# EAGLE design dashboard (EAGLE 6.3)
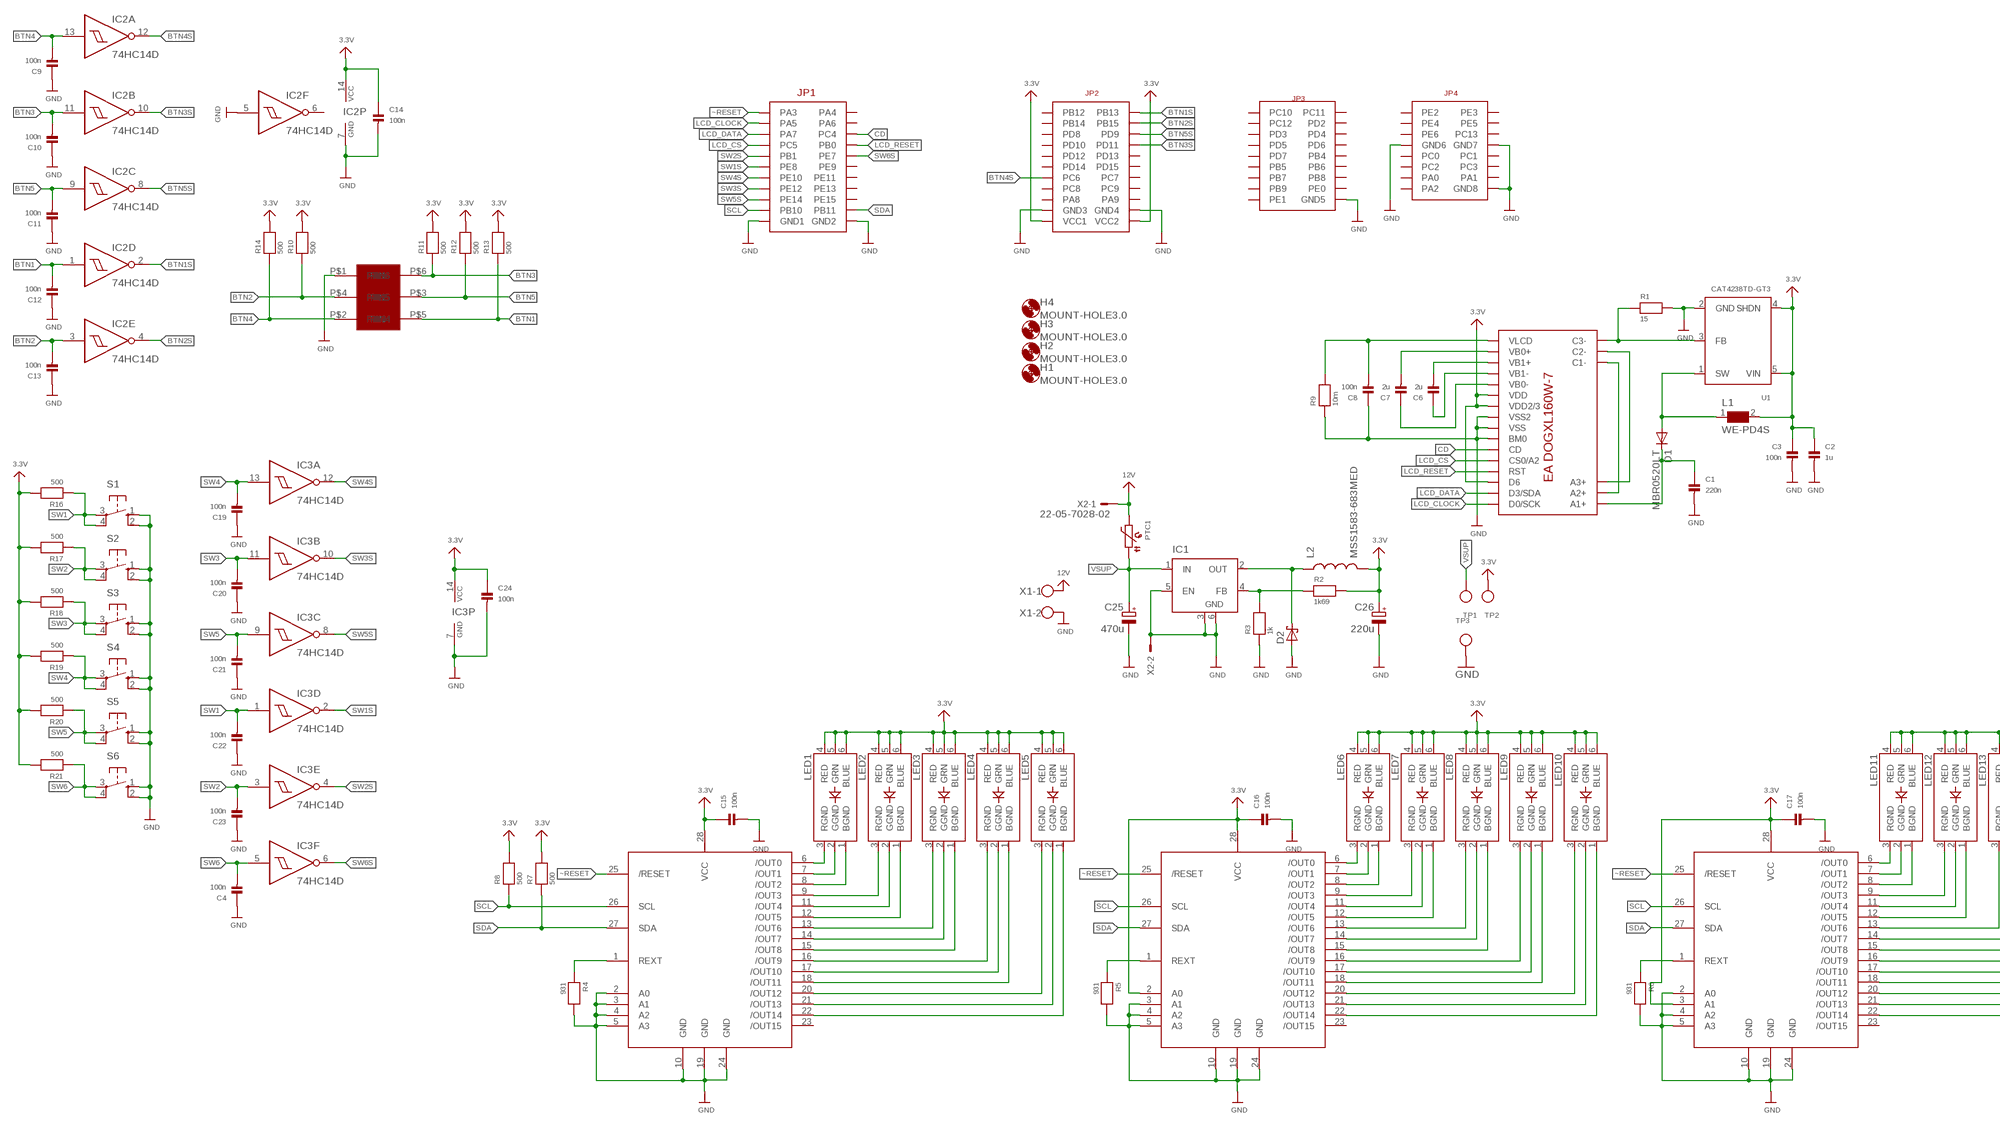
[diagram p0: schematic, sheet 1, part 1 of 2]
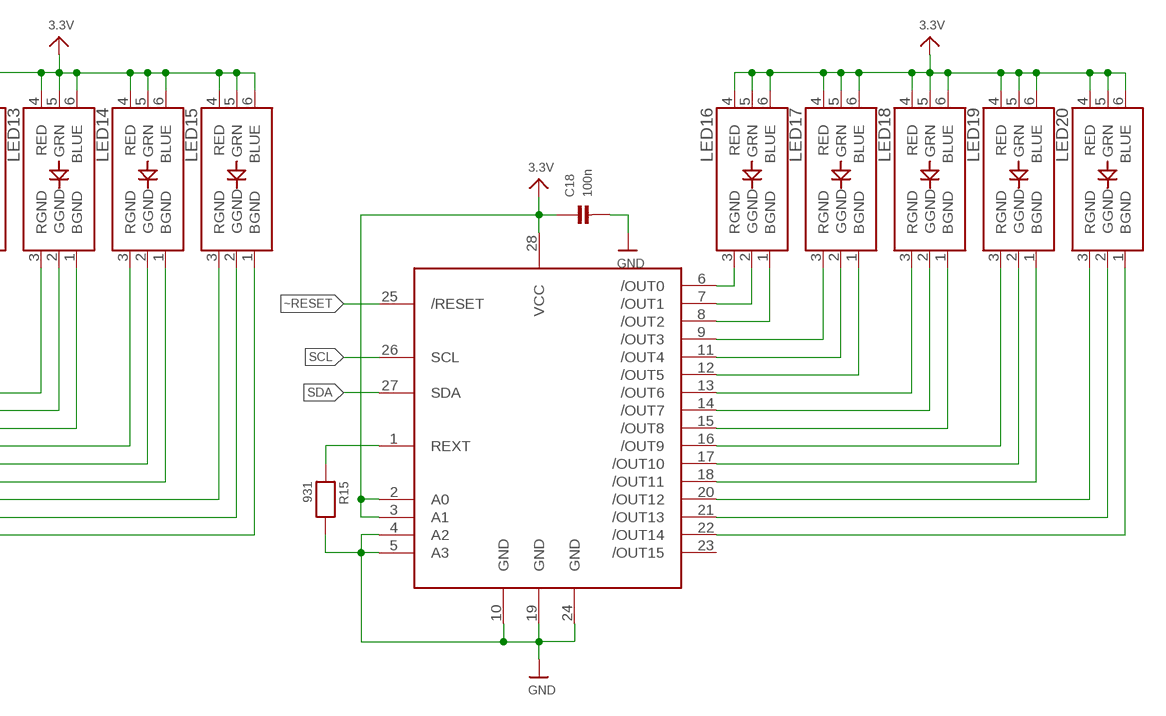
[diagram p1: schematic, sheet 1, part 2 of 2]

## Parts
C1  220n  CAP_CERAMIC_0805  [_0805]
C2  1u  CAP_CERAMIC_0805  [_0805]
C3  100n  CAP_CERAMIC_0603  [_0603]
C4  100n  CAP_CERAMIC_0603  [_0603]
C6  2u  CAP_CERAMIC_0805  [_0805]
C7  2u  CAP_CERAMIC_0805  [_0805]
C8  100n  CAP_CERAMIC_0603  [_0603]
C9  100n  CAP_CERAMIC_0603  [_0603]
C10  100n  CAP_CERAMIC_0603  [_0603]
C11  100n  CAP_CERAMIC_0603  [_0603]
C12  100n  CAP_CERAMIC_0603  [_0603]
C13  100n  CAP_CERAMIC_0603  [_0603]
C14  100n  CAP_CERAMIC_0603  [_0603]
C15  100n  CAP_CERAMIC_0603  [_0603]
C16  100n  CAP_CERAMIC_0603  [_0603]
C17  100n  CAP_CERAMIC_0603  [_0603]
C18  100n  CAP_CERAMIC_0603  [_0603]
C19  100n  CAP_CERAMIC_0603  [_0603]
C20  100n  CAP_CERAMIC_0603  [_0603]
C21  100n  CAP_CERAMIC_0603  [_0603]
C22  100n  CAP_CERAMIC_0603  [_0603]
C23  100n  CAP_CERAMIC_0603  [_0603]
C24  100n  CAP_CERAMIC_0603  [_0603]
C25  470u  CPOL-EU153CLV-1012  [153CLV-1012]
C26  220u  CPOL-EU153CLV-1012  [153CLV-1012]
D1  MBR0520LT  [SOD123]
D2  SCHOTTKY-DIODESMC  [SMC]
H1  MOUNT-HOLE3.0  [3,0]
H2  MOUNT-HOLE3.0  [3,0]
H3  MOUNT-HOLE3.0  [3,0]
H4  MOUNT-HOLE3.0  [3,0]
IC1  LM2596S  [TO263-5]
IC2  74HC14D  [SO14]
IC3  74HC14D  [SO14]
L1  WE-PD4S  WE-PD4-7445501_S  [S]
L2  MSS1583-683MED  INDUCTORPWR  [CDRH125]
LED1  LED_RGB_PLCC6CREE-CLV6A  [RGBLED_PLCC6]
LED2  LED_RGB_PLCC6CREE-CLV6A  [RGBLED_PLCC6]
LED3  LED_RGB_PLCC6CREE-CLV6A  [RGBLED_PLCC6]
LED4  LED_RGB_PLCC6CREE-CLV6A  [RGBLED_PLCC6]
LED5  LED_RGB_PLCC6CREE-CLV6A  [RGBLED_PLCC6]
LED6  LED_RGB_PLCC6CREE-CLV6A  [RGBLED_PLCC6]
LED7  LED_RGB_PLCC6CREE-CLV6A  [RGBLED_PLCC6]
LED8  LED_RGB_PLCC6CREE-CLV6A  [RGBLED_PLCC6]
LED9  LED_RGB_PLCC6CREE-CLV6A  [RGBLED_PLCC6]
LED10  LED_RGB_PLCC6CREE-CLV6A  [RGBLED_PLCC6]
LED11  LED_RGB_PLCC6CREE-CLV6A  [RGBLED_PLCC6]
LED12  LED_RGB_PLCC6CREE-CLV6A  [RGBLED_PLCC6]
LED13  LED_RGB_PLCC6CREE-CLV6A  [RGBLED_PLCC6]
LED14  LED_RGB_PLCC6CREE-CLV6A  [RGBLED_PLCC6]
LED15  LED_RGB_PLCC6CREE-CLV6A  [RGBLED_PLCC6]
LED16  LED_RGB_PLCC6CREE-CLV6A  [RGBLED_PLCC6]
LED17  LED_RGB_PLCC6CREE-CLV6A  [RGBLED_PLCC6]
LED18  LED_RGB_PLCC6CREE-CLV6A  [RGBLED_PLCC6]
LED19  LED_RGB_PLCC6CREE-CLV6A  [RGBLED_PLCC6]
LED20  LED_RGB_PLCC6CREE-CLV6A  [RGBLED_PLCC6]
PTC1  PTC1812  [PTC1812]
R1  15  RESISTOR_0603  [_0603]
R2  1k69  RESISTOR_0603  [_0603]
R3  1k  RESISTOR_0603  [_0603]
R4  931  RESISTOR_0603  [_0603]
R5  931  RESISTOR_0603  [_0603]
R6  931  RESISTOR_0603  [_0603]
R7  500  RESISTOR_0603  [_0603]
R8  500  RESISTOR_0603  [_0603]
R9  10m  RESISTOR_0805  [_0805]
R10  500  RESISTOR_0603  [_0603]
R11  500  RESISTOR_0603  [_0603]
R12  500  RESISTOR_0603  [_0603]
R13  500  RESISTOR_0603  [_0603]
R14  500  RESISTOR_0603  [_0603]
R15  931  RESISTOR_0603  [_0603]
R16  500  RESISTOR_0603  [_0603]
R17  500  RESISTOR_0603  [_0603]
R18  500  RESISTOR_0603  [_0603]
R19  500  RESISTOR_0603  [_0603]
R20  500  RESISTOR_0603  [_0603]
R21  500  RESISTOR_0603  [_0603]
S1  10-XX  [B3F-10XX]
S2  10-XX  [B3F-10XX]
S3  10-XX  [B3F-10XX]
S4  10-XX  [B3F-10XX]
S5  10-XX  [B3F-10XX]
S6  10-XX  [B3F-10XX]
TP1  TESTPOINT  [TESTPOINT_SMT]
TP2  TESTPOINT  [TESTPOINT_SMT]
TP3  TESTPOINT  [TESTPOINT_SMT]
U1  CAT4238TD-GT3  FAN5331  [SOT23-5]
U$1  CPU-BOARD  [CPU-BOARD-JP1]
U$10  EA-DOGXL160W-7  [EA-DOGXL160W-7]
U$30  TLC59116  [TSSOP28]
U$33  TLC59116  [TSSOP28]
U$36  TLC59116  [TSSOP28]
U$42  MICROFIT6  [43045-0600]
U$51  TLC59116  [TSSOP28]
X1  W237-102  [W237-102]
X2  22-05-7028-02  [7395-02]

## Nets
3.3V: C2.1 C3.1 C14.1 C15.1 C16.1 C17.1 C18.1 C24.1 C26.+ IC2.14(P:VCC) IC3.14(P:VCC) L1.2 L2.2 LED1.4(RED) LED1.5(GRN) LED1.6(BLUE) LED2.4(RED) LED2.5(GRN) LED2.6(BLUE) LED3.4(RED) LED3.5(GRN) LED3.6(BLUE) LED4.4(RED) LED4.5(GRN) LED4.6(BLUE) LED5.4(RED) LED5.5(GRN) LED5.6(BLUE) LED6.4(RED) LED6.5(GRN) LED6.6(BLUE) LED7.4(RED) LED7.5(GRN) LED7.6(BLUE) LED8.4(RED) LED8.5(GRN) LED8.6(BLUE) LED9.4(RED) LED9.5(GRN) LED9.6(BLUE) LED10.4(RED) LED10.5(GRN) LED10.6(BLUE) LED11.4(RED) LED11.5(GRN) LED11.6(BLUE) LED12.4(RED) LED12.5(GRN) LED12.6(BLUE) LED13.4(RED) LED13.5(GRN) LED13.6(BLUE) LED14.4(RED) LED14.5(GRN) LED14.6(BLUE) LED15.4(RED) LED15.5(GRN) LED15.6(BLUE) LED16.4(RED) LED16.5(GRN) LED16.6(BLUE) LED17.4(RED) LED17.5(GRN) LED17.6(BLUE) LED18.4(RED) LED18.5(GRN) LED18.6(BLUE) LED19.4(RED) LED19.5(GRN) LED19.6(BLUE) LED20.4(RED) LED20.5(GRN) LED20.6(BLUE) R2.2 R7.2 R8.2 R10.2 R11.2 R12.2 R13.2 R14.2 R16.2 R17.2 R18.2 R19.2 R20.2 R21.2 TP2.P$1 U1.4(SHDN) U1.5(VIN) U$1.P$43(VCC1) U$1.P$44(VCC2) U$10.P$22(VDD) U$10.P$23(VDD2/3) U$10.P$30(D6) U$30.28(VCC) U$33.2(A0) U$33.28(VCC) U$36.3(A1) U$36.28(VCC) U$51.2(A0) U$51.3(A1) U$51.28(VCC)
12V: PTC1.P$2 X1.1 X2.1
BTN1: C12.2 IC2.1(D:I) R13.1 U$42.P$5(PIN4)
BTN1S: IC2.2(D:O) U$1.P$24(PB13)
BTN2: C13.2 IC2.3(E:I) R10.1 U$42.P$4(PIN2)
BTN2S: IC2.4(E:O) U$1.P$26(PB15)
BTN3: C10.2 IC2.11(B:I) R11.1 U$42.P$6(PIN6)
BTN3S: IC2.10(B:O) U$1.P$30(PD11)
BTN4: C9.2 IC2.13(A:I) R14.1 U$42.P$2(PIN3)
BTN4S: IC2.12(A:O) U$1.P$35(PC6)
BTN5: C11.2 IC2.9(C:I) R12.1 U$42.P$3(PIN5)
BTN5S: IC2.8(C:O) U$1.P$28(PD9)
CD: U$1.P$6(PC4) U$10.P$27(CD)
GND: C1.2 C2.2 C3.2 C4.1 C8.1 C9.1 C10.1 C11.1 C12.1 C13.1 C14.2 C15.2 C16.2 C17.2 C18.2 C19.1 C20.1 C21.1 C22.1 C23.1 C24.2 C25.- C26.- D2.A IC1.3(GND) IC1.5(EN) IC1.6(GND) IC2.5(F:I) IC2.7(P:GND) IC3.7(P:GND) R1.2 R3.1 R4.2 R5.2 R6.2 R9.1 R15.2 S1.1(S) S1.2(S1) S2.1(S) S2.2(S1) S3.1(S) S3.2(S1) S4.1(S) S4.2(S1) S5.1(S) S5.2(S1) S6.1(S) S6.2(S1) TP3.P$1 U1.2(GND) U$1.P$19(GND1) U$1.P$20(GND2) U$1.P$41(GND3) U$1.P$42(GND4) U$1.P$62(GND5) U$1.P$69(GND6) U$1.P$70(GND7) U$1.P$78(GND8) U$10.P$24(VSS2) U$10.P$25(VSS) U$10.P$26(BM0) U$30.2(A0) U$30.3(A1) U$30.4(A2) U$30.5(A3) U$30.10(GND) U$30.19(GND) U$30.24(GND) U$33.3(A1) U$33.4(A2) U$33.5(A3) U$33.10(GND) U$33.19(GND) U$33.24(GND) U$36.2(A0) U$36.4(A2) U$36.5(A3) U$36.10(GND) U$36.19(GND) U$36.24(GND) U$42.P$1(PIN1) U$51.4(A2) U$51.5(A3) U$51.10(GND) U$51.19(GND) U$51.24(GND) X1.2 X2.2
LCD_CLOCK: U$1.P$3(PA5) U$10.P$32(D0/SCK)
LCD_CS: U$1.P$7(PC5) U$10.P$28(CS0/A2)
LCD_DATA: U$1.P$5(PA7) U$10.P$31(D3/SDA)
LCD_RESET: U$1.P$8(PB0) U$10.P$29(RST)
N$1: U$10.P$2(A2+) U$10.P$14(C1-)
N$2: U$10.P$3(A3+) U$10.P$15(C2-)
N$3: R1.1 U1.3(FB) U$10.P$16(C3-)
N$4: C1.1 D1.C U$10.P$1(A1+)
N$5: D1.A L1.1 U1.1(SW)
N$6: D2.C IC1.2(OUT) L2.1
N$7: LED1.3(RGND) U$30.6(/OUT0)
N$8: LED1.2(GGND) U$30.7(/OUT1)
N$9: IC1.4(FB) R2.1 R3.2
N$10: LED1.1(BGND) U$30.8(/OUT2)
N$11: LED2.3(RGND) U$30.9(/OUT3)
N$12: LED2.2(GGND) U$30.11(/OUT4)
N$13: LED2.1(BGND) U$30.12(/OUT5)
N$14: LED3.3(RGND) U$30.13(/OUT6)
N$15: LED3.2(GGND) U$30.14(/OUT7)
N$16: LED3.1(BGND) U$30.15(/OUT8)
N$17: LED4.3(RGND) U$30.16(/OUT9)
N$18: LED4.2(GGND) U$30.17(/OUT10)
N$19: LED4.1(BGND) U$30.18(/OUT11)
N$20: LED5.3(RGND) U$30.20(/OUT12)
N$21: LED5.2(GGND) U$30.21(/OUT13)
N$22: LED5.1(BGND) U$30.22(/OUT14)
N$23: LED6.3(RGND) U$33.6(/OUT0)
N$24: LED6.2(GGND) U$33.7(/OUT1)
N$25: LED6.1(BGND) U$33.8(/OUT2)
N$26: LED7.3(RGND) U$33.9(/OUT3)
N$27: LED7.2(GGND) U$33.11(/OUT4)
N$28: LED7.1(BGND) U$33.12(/OUT5)
N$29: LED8.3(RGND) U$33.13(/OUT6)
N$30: LED8.2(GGND) U$33.14(/OUT7)
N$31: LED8.1(BGND) U$33.15(/OUT8)
N$32: LED9.3(RGND) U$33.16(/OUT9)
N$33: LED9.2(GGND) U$33.17(/OUT10)
N$34: LED9.1(BGND) U$33.18(/OUT11)
N$35: LED10.3(RGND) U$33.20(/OUT12)
N$36: LED10.2(GGND) U$33.21(/OUT13)
N$37: LED10.1(BGND) U$33.22(/OUT14)
N$38: LED11.3(RGND) U$36.6(/OUT0)
N$39: LED11.2(GGND) U$36.7(/OUT1)
N$40: LED11.1(BGND) U$36.8(/OUT2)
N$41: LED12.3(RGND) U$36.9(/OUT3)
N$42: LED12.2(GGND) U$36.11(/OUT4)
N$43: LED12.1(BGND) U$36.12(/OUT5)
N$44: LED13.3(RGND) U$36.13(/OUT6)
N$45: LED13.2(GGND) U$36.14(/OUT7)
N$46: LED13.1(BGND) U$36.15(/OUT8)
N$47: LED14.3(RGND) U$36.16(/OUT9)
N$48: LED14.2(GGND) U$36.17(/OUT10)
N$49: LED14.1(BGND) U$36.18(/OUT11)
N$50: LED15.3(RGND) U$36.20(/OUT12)
N$51: LED15.2(GGND) U$36.21(/OUT13)
N$52: LED15.1(BGND) U$36.22(/OUT14)
N$53: R4.1 U$30.1(REXT)
N$54: LED16.3(RGND) U$51.6(/OUT0)
N$55: R5.1 U$33.1(REXT)
N$56: R6.1 U$36.1(REXT)
N$57: C6.1 U$10.P$20(VB1-)
N$58: C7.1 U$10.P$21(VB0-)
N$59: C6.2 U$10.P$19(VB1+)
N$60: C7.2 U$10.P$18(VB0+)
N$61: C8.2 R9.2 U$10.P$17(VLCD)
N$62: LED16.2(GGND) U$51.7(/OUT1)
N$63: LED16.1(BGND) U$51.8(/OUT2)
N$64: LED17.3(RGND) U$51.9(/OUT3)
N$65: LED17.2(GGND) U$51.11(/OUT4)
N$66: LED17.1(BGND) U$51.12(/OUT5)
N$67: LED18.3(RGND) U$51.13(/OUT6)
N$68: LED18.2(GGND) U$51.14(/OUT7)
N$69: LED18.1(BGND) U$51.15(/OUT8)
N$70: LED19.3(RGND) U$51.16(/OUT9)
N$71: LED19.2(GGND) U$51.17(/OUT10)
N$72: LED19.1(BGND) U$51.18(/OUT11)
N$73: LED20.3(RGND) U$51.20(/OUT12)
N$74: LED20.2(GGND) U$51.21(/OUT13)
N$75: LED20.1(BGND) U$51.22(/OUT14)
N$76: R15.1 U$51.1(REXT)
SCL: R8.1 U$1.P$21(PB10) U$30.26(SCL) U$33.26(SCL) U$36.26(SCL) U$51.26(SCL)
SDA: R7.1 U$1.P$22(PB11) U$30.27(SDA) U$33.27(SDA) U$36.27(SDA) U$51.27(SDA)
SW1: C22.2 IC3.1(D:I) R16.1 S1.3(P) S1.4(P1)
SW1S: IC3.2(D:O) U$1.P$11(PE8)
SW2: C23.2 IC3.3(E:I) R17.1 S2.3(P) S2.4(P1)
SW2S: IC3.4(E:O) U$1.P$9(PB1)
SW3: C20.2 IC3.11(B:I) R18.1 S3.3(P) S3.4(P1)
SW3S: IC3.10(B:O) U$1.P$15(PE12)
SW4: C19.2 IC3.13(A:I) R19.1 S4.3(P) S4.4(P1)
SW4S: IC3.12(A:O) U$1.P$13(PE10)
SW5: C21.2 IC3.9(C:I) R20.1 S5.3(P) S5.4(P1)
SW5S: IC3.8(C:O) U$1.P$17(PE14)
SW6: C4.2 IC3.5(F:I) R21.1 S6.3(P) S6.4(P1)
SW6S: IC3.6(F:O) U$1.P$10(PE7)
VSUP: C25.+ IC1.1(IN) PTC1.P$1 TP1.P$1
~RESET: U$1.P$1(PA3) U$30.25(/RESET) U$33.25(/RESET) U$36.25(/RESET) U$51.25(/RESET)
Unconnected: IC2.6(F:O) U$1.P$2(PA4) U$1.P$4(PA6) U$1.P$12(PE9) U$1.P$14(PE11) U$1.P$16(PE13) U$1.P$18(PE15) U$1.P$23(PB12) U$1.P$25(PB14) U$1.P$27(PD8) U$1.P$29(PD10) U$1.P$31(PD12) U$1.P$32(PD13) U$1.P$33(PD14) U$1.P$34(PD15) U$1.P$36(PC7) U$1.P$37(PC8) U$1.P$38(PC9) U$1.P$39(PA8) U$1.P$40(PA9) U$1.P$45(PC10) U$1.P$46(PC11) U$1.P$47(PC12) U$1.P$48(PD2) U$1.P$49(PD3) U$1.P$50(PD4) U$1.P$51(PD5) U$1.P$52(PD6) U$1.P$53(PD7) U$1.P$54(PB4) U$1.P$55(PB5) U$1.P$56(PB6) U$1.P$57(PB7) U$1.P$58(PB8) U$1.P$59(PB9) U$1.P$60(PE0) U$1.P$61(PE1) U$1.P$63(PE2) U$1.P$64(PE3) U$1.P$65(PE4) U$1.P$66(PE5) U$1.P$67(PE6) U$1.P$68(PC13) U$1.P$71(PC0) U$1.P$72(PC1) U$1.P$73(PC2) U$1.P$74(PC3) U$1.P$75(PA0) U$1.P$76(PA1) U$1.P$77(PA2) U$30.23(/OUT15) U$33.23(/OUT15) U$36.23(/OUT15) U$51.23(/OUT15)

## Library data of the parts
C1-C4 C6-C24 = microbuilder:CAP_CERAMIC: Ceramic Capacitors 0402 - 0402 Surface Mount Capacitors 16pF 50V 5% [Digikey: 445-4899-2-ND] 18pF 50V 5% [Digikey: 490-1281-2-ND] 22pF 50V 5% [Digikey: 490-1283-2-ND] 68pF 50V 5% [Digikey: 490-1289-2-ND] 0.1uF 10V 10% [Digikey: 490-1318-2-ND] 1.0uF 6.3V 10% [Digikey: 490-1320-2-ND] 0603 - 0603 Surface Mount Capacitors 16 pF 50V 5% [Digikey: 445-5051-2-ND] 22 pF 50V [Digikey: PCC220ACVTR-ND] 33 pF 50V 5% [Digikey: 490-1415-1-ND] 56pF 50V 5% [Digikey: 490-1421-1-ND] 220pF 50V 5% [Digikey: 445-1285-1-ND] 680 pF 50V 2200 pF 50V 5% C0G [Digikey: 445-1297-1-ND] 5600 pF 100V 5% X7R [Digikey: 478-3711-1-ND] 0.1 µF 25V 10% [Digikey: PCC2277TR-ND] 0.22 µF 16V 10% X7R [Digikey: 445-1318-1-ND] 1.0 µF 25V 10% [Digikey: 445-5146-2-ND] 0603 - RF Specific 3pF 250V +/-0.1pF RF [Digikey: 712-1347-1-ND] 18 pF 250V 5% [Digikey: 478-3505-1-ND or 712-1322-1-ND] 56 pF 250V 5% C0G RF [Digikey: 490-4867-1-ND] 68 pF 250V RF [Digikey: 490-4868-1-ND] 0805 - 0805 Surface Mount Capacitors 220 pF 250V 2% RF Ceramic Capacitor [Digikey: 712-1398-1-ND] 1000 pF 50V 2% NP0 Ceramic Capacitor [Digikey: 478-3760-1-ND] 0.1 µF 25V 10% Ceramic Capacitor [Digikey: PCC1828TR-ND] 1.0 µF 16V 10% Ceramic Capacitor[Digikey: 490-1691-2-ND] 10.0 µF 10V 10% Ceramic Capacitor[Digikey: 709-1228-1-ND] 10.0 uF 16V 10% Ceramic Capacitor [Digikey: 478-5165-2-ND] 47 uF 6.3V 20% Ceramic Capacitor [Digikey: 587-1779-1-ND or 399-5506-1-ND] 1206 - 1206 Surface Mount Capacitors 47uF 10V 20% Ceramic Capacitor [Digikey: 490-5528-1-ND or 399-5508-1-ND or 445-6010-1-ND] 100uF 6.3V -20%, +80% Y5V Ceramic Capacitor (Digikey: 490-4512-1-ND, Mouser: 81-GRM31CF50J107ZE1L)
C25 C26 = rcl:CPOL-EU: POLARIZED CAPACITOR, European symbol
D1 = diode:MBR0520LT: SCHOTTKY BARRIER RECTIFIER Source: http://onsemi.com .. MBR0520LT1-D.pdf
D2 = diode:SCHOTTKY-DIODE: Schottky Diode
H1-H4 = holes:MOUNT-HOLE: MOUNTING HOLE with drill center marker
IC1 = linear:LM2596S: STEP-DOWN VOLTAGE REGULATOR
IC2 IC3 = 74xx-eu:74*14: Hex schmitt trigger INVERTER
L1 = WE-PD4:WE-PD4: SMD-Power Inductors WE-PD4 - Current loading up to 35 A - Compact size - Low-loss ferrite core - High storage capacity - Industry standardized size - Application frequency range up to 10 MHz -- Is recommended for the application with switching regulators from National Semiconductor, Linear Technology, Texas Instruments and Fairchild Semiconductor -- Noise suppression -- Perfectly suitable for switching regulators with extremely high efficiency; MPN: 7445501; OC_FARNELL: 1636112; OC_NEWARK: 08P2667; PACKAGE: Type S; SUPPLIER: Wuerth Elektronik
L2 = SparkFun-Passives:INDUCTOR: Inductors Basic Inductor/Choke - 0603 and 1206. Footprints are not proven and vary greatly between part numbers. INDUCTOR POWER 3.3UH 4.0A SMD 0.197" L x 0.197" W x 0.177" H (5.00mm x 5.00mm x 4.50mm)
LED1-LED20 = microbuilder:LED_RGB_PLCC6: RGB LED Cree CLV6A-FKB - Digikey: CLV6A-FKB-CK1P1G1BB7R3R3TR-ND DC Foreward Current: 20mA Foreward Voltage: R = 2.0, G = 3.2, B = 3.2 Viewing Angle: 120°
PTC1 = microbuilder:PTC: PTC (Resettable Fuse) 1206 Package 250mA PTC (16V Max, Time-to-Trip: 0.08s) - Digikey: F2110CT-ND 1210 Package 100mA PTC (30V Max, Time-to-Trip: 0.6s) - Digikey: MF-USMF010-2CT-ND 1812 Package 750mA PTC (24V Max, Time-to-Trip: 0.2s) - Digikey: MF-MSMF075/24-2CT-ND
R1-R21 = microbuilder:RESISTOR: Resistors 0402 - 0402 Surface Mount Package 22 Ohm 1% 1/16W [Digikey: 311-22.0LRTR-ND] 33 Ohm 5% 1/16W 1.0K 5% 1/16W 1.5K 5% 1/16W 2.0K 1% 1/16W 10.0K 1% 1/16W [Digikey: 311-10.0KLRTR-ND] 10.0K 5% 1/16W [Digikey: RMCF0402JT10K0TR-ND] 12.1K 1% 1/16W [Digikey: 311-22.0LRTR-ND] 100.0K 5% 1/16W 0603 - 0603 Surface Mount Package 0 Ohm 1/10 Watt 1% Resistor 15 Ohm 1/10 Watt 1% Resistor 33 Ohm 1/10 Watt 1% Resistor 49.9 Ohm 1/10 Watt 1% Resistor 100 Ohm 1/10 Watt 1% Resistor 150 Ohm 1/10 Watt 1% Resistor 240 Ohm 1/10 Watt 1% Resistor 390 Ohm 1/10 Watt 1% Resistor 560 Ohm 1/10 Watt 1% Resistor 680 Ohm 1/10 Watt 1% Resistor 750 Ohm 1/10 Watt 1% Resistor 1.0K Ohm 1/10 Watt 1% Resistor 1.5K Ohm 1/10 Watt 1% Resistor 2.0K Ohm 1/10 Watt 1% Resistor 2.2K Ohm 1/10 Watt 1% Resistor 3.3K Ohm 1/10 Watt 1% Resistor 4.7K Ohm 1/10 Watt 1% Resistor 10.0K Ohm 1/10 Watt 1% Resistor 12.0K Ohm 1/10 Watt 1% Resistor 12.1K Ohm 1/10 Watt 1% Resistor 20.0K Ohm 1/10 Watt 1% Resistor 33.0K Ohm 1/10 Watt 1% Resistor 100.0K Ohm 1/10 Watt 1% Resistor 0805 - 0805 Surface Mount Package 0 Ohm 1/8 Watt 1% Resistor 33 Ohm 1/8 Watt 1% Resistor 100 Ohm 1/8 Watt 1% Resistor 150 Ohm 1/8 Watt 1% Resistor 200 Ohm 1/8 Watt 1% Resistor 240 Ohm 1/8 Watt 1% Resistor 330 Ohm 1/8 Watt 1% Resistor 390 Ohm 1/8 Watt 1% Resistor 470 Ohm 1/8 Watt 1% Resistor 1.0K Ohm 1/8 Watt 1% Resistor 1.5K Ohm 1/8 Watt 1% Resistor 2.0K Ohm 1/8 Watt 1% Resistor 4.7K Ohm 1/8 Watt 1% Resistor 5.1K Ohm 1/8 Watt 1% Resistor 5.6K Ohm 1/8 Watt 1% Resistor 10.0K Ohm 1/8 Watt 1% Resistor 22.0K Ohm 1/8 Watt 1% Resistor 33.0K Ohm 1/8 Watt 1% Resistor 100K Ohm 1/8 Watt 1% Resistor 1206 - 1206 Surface Mount Package 2012 - 2010 Surface Mount Package 0.11 Ohm 1/2 Watt 1% Resistor - Digikey: RHM.11UCT-ND
S1-S6 = switch-omron:10-XX: OMRON SWITCH; MPN: B3F-1000; OC_FARNELL: 176432; OC_NEWARK: 36M3542
TP1-TP3 = microbuilder:TESTPOINT: Test Point Various test points for characterisation and PCB testing TESTPOINT_SMT - Compact Surface Mount Test Point [Digikey: 5016KTR-ND]
U1 = microbuilder:FAN5331: FAN5331 - LED/OLED 20V Boost Converter Digikey: FAN5331SXCT-ND
U$1 = unicorn_v2:CPU-BOARD
U$10 = unicorn_v2:EA-DOGXL160W-7
U$30 U$33 U$36 U$51 = tlc:TLC59116
U$42 = unicorn:MICROFIT6
X1 = con-wago-500:W237-102: WAGO SCREW CLAMP; MPN: 237-102; OC_FARNELL: unknown; OC_NEWARK: 70K9898
X2 = con-molex:22-?-02: CONNECTOR wire to board 2.54 mm (.1 inch) pitch header; OC_FARNELL: 9731601; OC_NEWARK: unknown

## Board
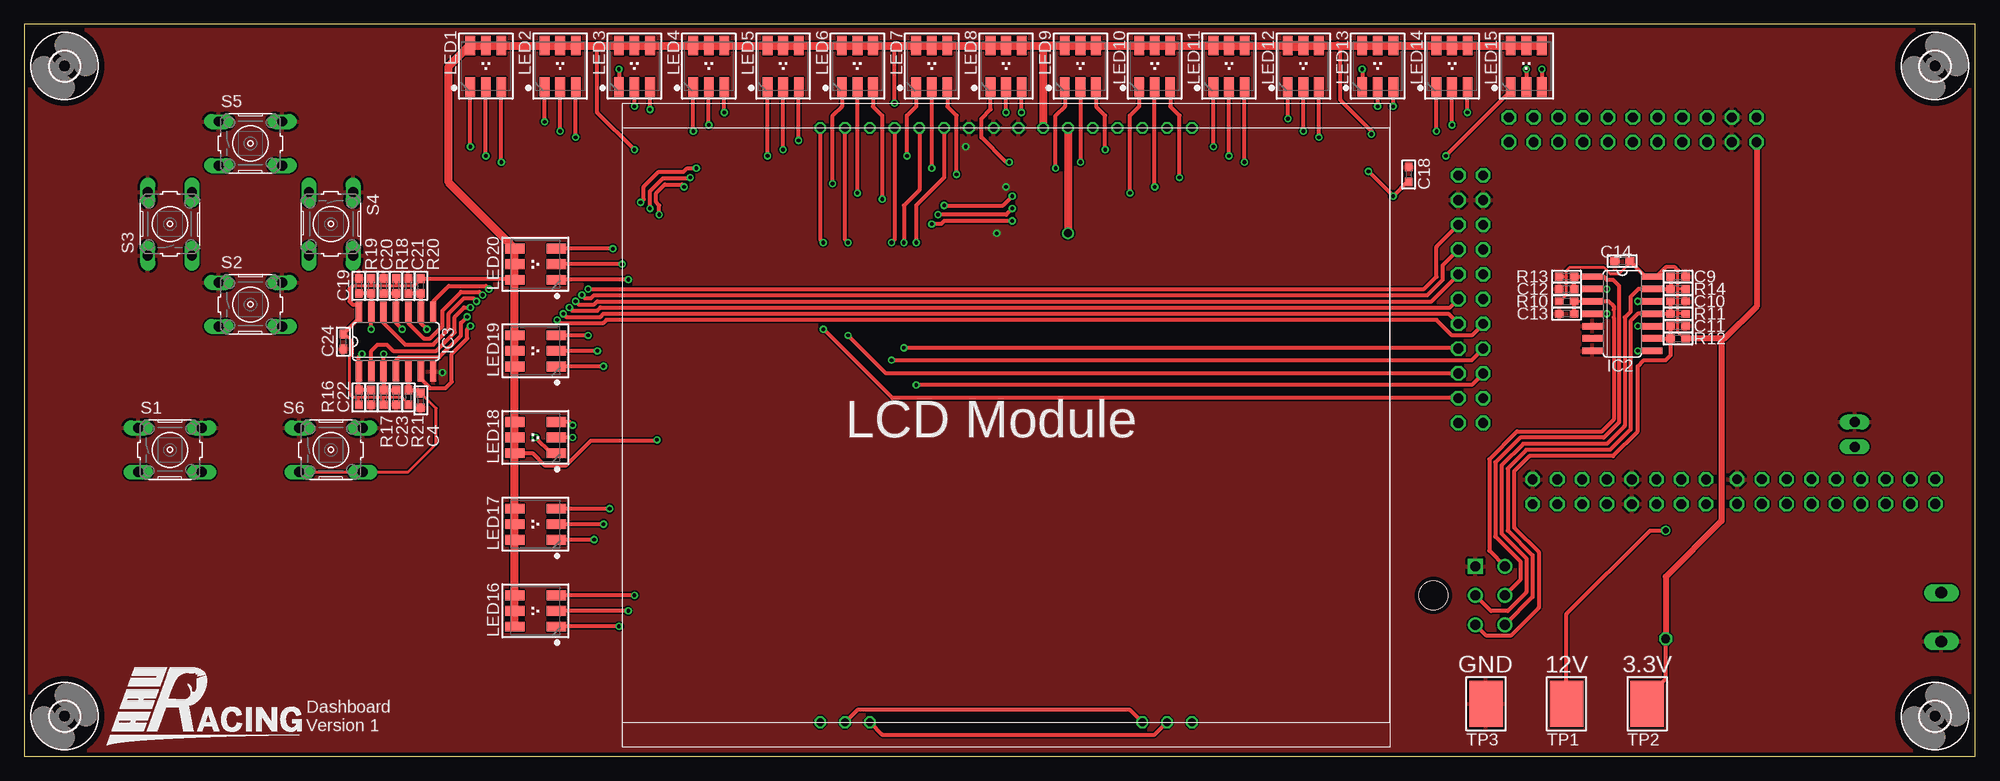
[diagram p2: board, top side]
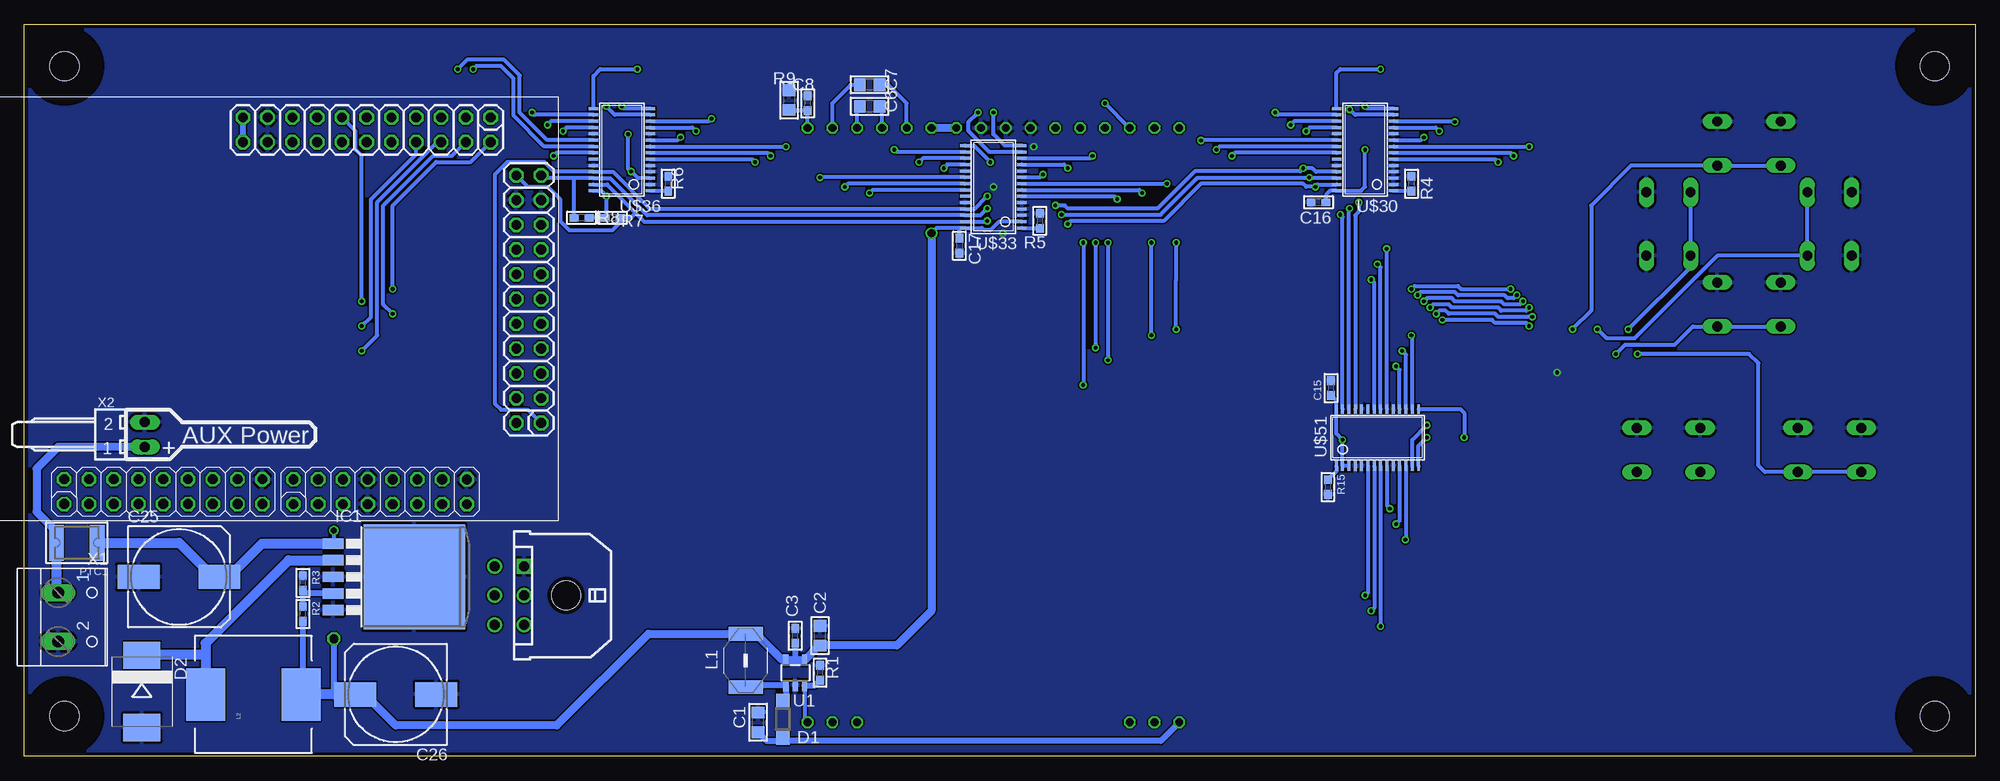
[diagram p3: board, bottom side, seen from below]

Size 200 x 75.08 mm. Coordinates in mm from the lower left corner, seen from the top.
Outline: 0,0 200,0 200,75.08 0,75.08 0,0
Copper layers (1*16): Top 0.0356mm / dielectric 1.5011mm / Bottom 0.0356mm
Design rules "LaenPCBOrder": minimum track width 6mil, minimum drill 13mil, track to track 6mil, track to pad 6mil, pad to pad 6mil, via to via 6mil, smd to smd 6mil, copper to edge 15mil, drill to drill 6mil, minimum pad ring 7mil, minimum via ring 7mil, stop-mask expansion 3mil, vias tented up to drill 0mil, thermal gap 10mil

### Footprints (pad centres in the part's own frame; a part is rotated, then mirrored left to right if it is on the bottom)
_0805 = smd 1.2 x 1.3: 1 -1.016,0; 2 1.016,0
_0603 = smd 0.9 x 0.8: 1 -0.762,0; 2 0.762,0
153CLV-1012 = smd 4.3 x 2.5: + 4.15,0; - -4.15,0
SOD123 = smd 1.4 x 1.4: A 1.9,0; C -1.9,0
SMC = smd 2.8 x 3.8: A 3.7,0; C -3.7,0
3,0 = hole 3: 0,0
TO263-5 = smd 1.067 x 2.159: 1 -3.404,-5.791; 2 -1.702,-5.791; 3 0,-5.791; 4 1.702,-5.791; 5 3.404,-5.791 | smd 10.8 x 10.41: 6 0,2.54
SO14 = smd 0.66 x 2.032: 1 -3.81,-3.073; 2 -2.54,-3.073; 3 -1.27,-3.073; 4 0,-3.073; 5 1.27,-3.073; 6 2.54,-3.073; 7 3.81,-3.073; 8 3.81,3.073; 9 2.54,3.073; 10 1.27,3.073; 11 0,3.073; 12 -1.27,3.073; 13 -2.54,3.073; 14 -3.81,3.073
S = smd 1.4 x 3.56: 1 -2.73,0; 2 2.73,0
CDRH125 = smd 5.4 x 4: 1 0,4.9; 2 0,-4.9
RGBLED_PLCC6 = smd 1 x 2: 1 -1.6,-2.158; 2 0,-2.158; 3 1.6,-2.158; 4 1.6,2.108; 5 0,2.108; 6 -1.6,2.108
PTC1812 = smd 1.5 x 3.7: P$1 -2.1,0; P$2 2.1,0
B3F-10XX = drill 1.016 long: 1 -3.251,2.261; 2 3.251,2.261; 3 -3.251,-2.261; 4 3.251,-2.261
TESTPOINT_SMT = smd 4.7 x 3.4: P$1 0,0
SOT23-5 = smd 0.55 x 1.2: 1 -0.95,-1.3; 2 0,-1.3; 3 0.95,-1.3; 4 0.95,1.3; 5 -0.95,1.3
CPU-BOARD-JP1 = drill 1 octagon: P$1 1.27,-12.7; P$2 -1.27,-12.7; P$3 1.27,-10.16; P$4 -1.27,-10.16; P$5 1.27,-7.62; P$6 -1.27,-7.62; P$7 1.27,-5.08; P$8 -1.27,-5.08; P$9 1.27,-2.54; P$10 -1.27,-2.54; P$11 1.27,0; P$12 -1.27,0; P$13 1.27,2.54; P$14 -1.27,2.54; P$15 1.27,5.08; P$16 -1.27,5.08; P$17 1.27,7.62; P$18 -1.27,7.62; P$19 1.27,10.16; P$20 -1.27,10.16; P$21 1.27,12.7; P$22 -1.27,12.7; P$23 -3.905,18.637; P$24 -3.905,16.097; P$25 -6.445,18.637; P$26 -6.445,16.097; P$27 -8.985,18.637; P$28 -8.985,16.097; P$29 -11.525,18.637; P$30 -11.525,16.097; P$31 -14.065,18.637; P$32 -14.065,16.097; P$33 -16.605,18.637; P$34 -16.605,16.097; P$35 -19.145,18.637; P$36 -19.145,16.097; P$37 -21.685,18.637; P$38 -21.685,16.097; P$39 -24.225,18.637; P$40 -24.225,16.097; P$41 -26.765,18.637; P$42 -26.765,16.097; P$43 -29.305,18.637; P$44 -29.305,16.097; P$45 -47.625,-21.018; P$46 -47.625,-18.479; P$47 -45.085,-21.018; P$48 -45.085,-18.479; P$49 -42.545,-21.018; P$50 -42.545,-18.479; P$51 -40.005,-21.018; P$52 -40.005,-18.479; P$53 -37.465,-21.018; P$54 -37.465,-18.479; P$55 -34.925,-21.018; P$56 -34.925,-18.479; P$57 -32.385,-21.018; P$58 -32.385,-18.479; P$59 -29.845,-21.018; P$60 -29.845,-18.479; P$61 -27.305,-21.018; P$62 -27.305,-18.479; P$63 -24.115,-21.024; P$64 -24.115,-18.484; P$65 -21.575,-21.024; P$66 -21.575,-18.484; P$67 -19.035,-21.024; P$68 -19.035,-18.484; P$69 -16.495,-21.024; P$70 -16.495,-18.484; P$71 -13.955,-21.024; P$72 -13.955,-18.484; P$73 -11.415,-21.024; P$74 -11.415,-18.484; P$75 -8.875,-21.024; P$76 -8.875,-18.484; P$77 -6.335,-21.024; P$78 -6.335,-18.484
EA-DOGXL160W-7 = drill 0.8 octagon: P$1 20.32,2.54; P$2 22.86,2.54; P$3 25.4,2.54; P$14 53.34,2.54; P$15 55.88,2.54; P$16 58.42,2.54; P$17 58.42,63.5; P$18 55.88,63.5; P$19 53.34,63.5; P$20 50.8,63.5; P$21 48.26,63.5; P$22 45.72,63.5; P$23 43.18,63.5; P$24 40.64,63.5; P$25 38.1,63.5; P$26 35.56,63.5; P$27 33.02,63.5; P$28 30.48,63.5; P$29 27.94,63.5; P$30 25.4,63.5; P$31 22.86,63.5; P$32 20.32,63.5
TSSOP28 = smd 0.305 x 0.991: 1 -4.225,-2.918; 2 -3.575,-2.918; 3 -2.925,-2.918; 4 -2.275,-2.918; 5 -1.625,-2.918; 6 -0.975,-2.918; 7 -0.325,-2.918; 8 0.325,-2.918; 9 0.975,-2.918; 10 1.625,-2.918; 11 2.275,-2.918; 12 2.925,-2.918; 13 3.575,-2.918; 14 4.225,-2.918; 15 4.225,2.918; 16 3.575,2.918; 17 2.925,2.918; 18 2.275,2.918; 19 1.625,2.918; 20 0.975,2.918; 21 0.325,2.918; 22 -0.325,2.918; 23 -0.975,2.918; 24 -1.625,2.918; 25 -2.275,2.918; 26 -2.925,2.918; 27 -3.575,2.918; 28 -4.225,2.918
43045-0600 = drill 1.02 square: P$1 3,4.32 | drill 1.02: P$2 0,4.32; P$3 -3,4.32; P$4 3,7.32; P$5 0,7.32; P$6 -3,7.32 | hole 3: 0,0
W237-102 = drill 1.194 long: 1 -2.5,-1.27; 2 2.5,-1.27
7395-02 = drill 1.016 long: 1 1.27,0; 2 -1.27,0

### Placement (x,y rotation side)
C1  124.78,3.49 90 bottom
C2  118.43,12.38 90 bottom
C3  120.97,12.38 90 bottom
C4  40.64,36.51 90 top
C6  113.35,66.67 180 bottom
C7  113.35,68.9 180 bottom
C8  119.7,66.99 270 bottom
C9  169.54,49.21 180 top
C10  169.54,46.67 180 top
C11  169.54,44.13 180 top
C12  158.11,47.94 0 top
C13  158.11,45.4 0 top
C14  163.83,50.8 180 top
C15  66.04,37.78 90 bottom
C16  67.31,56.83 180 bottom
C17  104.14,52.39 270 bottom
C18  141.92,59.69 90 top
C19  34.29,48.26 270 top
C20  36.83,48.26 270 top
C21  39.37,48.26 270 top
C22  35.56,36.83 90 top
C23  38.1,36.83 90 top
C24  32.7,42.55 270 top
C25  184.15,18.41 0 bottom
C26  161.92,6.35 180 bottom
D1  122.24,3.81 90 bottom
D2  187.96,6.67 270 bottom
H1  4.13,4.13 0 top
H2  195.9,4.13 0 top
H3  195.9,70.8 0 top
H4  4.13,70.8 0 top
IC1  162.56,18.41 270 bottom
IC2  163.83,45.4 270 top
IC3  38.1,42.55 0 top
L1  126.05,9.84 90 bottom
L2  176.53,6.35 90 bottom
LED1  47.31,70.8 0 top
LED2  54.93,70.8 0 top
LED3  62.55,70.8 0 top
LED4  70.17,70.8 0 top
LED5  77.79,70.8 0 top
LED6  85.41,70.8 0 top
LED7  93.03,70.8 0 top
LED8  100.65,70.8 0 top
LED9  108.27,70.8 0 top
LED10  115.89,70.8 0 top
LED11  123.51,70.8 0 top
LED12  131.13,70.8 0 top
LED13  138.75,70.8 0 top
LED14  146.37,70.8 0 top
LED15  153.99,70.8 0 top
LED16  52.39,14.92 90 top
LED17  52.39,23.81 90 top
LED18  52.39,32.7 90 top
LED19  52.39,41.59 90 top
LED20  52.39,50.48 90 top
PTC1  194.63,21.91 180 bottom
R1  118.43,8.57 90 bottom
R2  171.45,14.6 270 bottom
R3  171.45,17.78 270 bottom
R4  57.79,58.74 90 bottom
R5  95.88,54.93 90 bottom
R6  133.98,58.74 90 bottom
R7  139.7,55.24 180 bottom
R8  142.88,55.24 0 bottom
R9  121.6,67.31 270 bottom
R10  158.11,46.67 180 top
R11  169.54,45.4 0 top
R12  169.54,42.86 0 top
R13  158.11,49.21 180 top
R14  169.54,47.94 0 top
R15  66.36,27.62 270 bottom
R16  34.29,36.83 270 top
R17  36.83,36.83 270 top
R18  38.1,48.26 90 top
R19  35.56,48.26 90 top
R20  40.64,48.26 90 top
R21  39.37,36.83 270 top
S1  14.92,31.43 0 top
S2  23.18,46.36 0 top
S3  14.92,54.61 90 top
S4  31.43,54.61 270 top
S5  23.18,62.86 0 top
S6  31.43,31.43 0 top
TP1  158.11,5.4 90 top
TP2  166.37,5.4 90 top
TP3  149.86,5.4 90 top
U1  120.97,8.57 0 bottom
U$1  148.3,46.9 0 bottom
U$10  61.28,0.95 0 top
U$30  62.55,62.23 90 bottom
U$33  100.65,58.42 90 bottom
U$36  138.75,62.23 90 bottom
U$42  144.46,16.51 90 bottom
U$51  61.28,32.7 0 bottom
X1  195.26,14.29 270 bottom
X2  187.64,33.02 270 bottom

### Tracks (layer width: path | path; a pad name or v marks a point on that pad's centre or on a via)
3.3V  (via drill 0.38, 0.8, 0.9)
  Top 0.305: 166.18,49.21 IC2.14 167.32,49.21 | 169.54,45.4 169.54,43.5 170.18,42.86 R12.2 | 169.54,45.4 169.54,47.94 | 169.54,47.94 169.54,49.85 | C14.1 164.59,50.61 163.51,49.53 162.56,49.53 161.92,50.16 158.43,50.16 158.11,49.85 158.11,49.21 | 158.11,49.21 158.11,47.31 157.48,46.67 R10.2 | R13.2 158.11,49.21 | R14.2 169.54,47.94 | R11.2 169.54,45.4 | R20.2 40.64,48.89 40.01,48.26 38.1,48.26 | 38.1,48.26 35.56,48.26 | 35.56,48.26 33.65,48.26 | 34.29,46.36 IC3.14 | R19.2 35.56,48.26 | R18.2 38.1,48.26 | R17.2 36.83,36.83 | 36.83,36.83 34.29,36.83 | 34.29,36.83 33.65,36.83 33.34,37.15 33.34,40.96 33.65,41.27 33.65,42.55 32.89,43.31 C24.1 | R16.2 34.29,36.83 | 50.14,49.02 LED20.6 | R21.2 39.37,36.19 38.74,36.83 36.83,36.83
  Top 0.406: v62.55,62.23 58.74,66.04 58.74,72.91 | v138.11,63.82 138.11,64.13 134.94,67.31 134.94,72.59 134.62,72.91 | v137.79,60.01 v140.33,57.47 141.8,58.93 C18.1 | v89.22,66.99 89.22,72.59 89.53,72.91 | LED18.6 52.08,31.1 53.34,29.84 55.56,29.84 58.1,32.39 64.77,32.39 v64.85,32.47 | C14.1 166.18,49.21 | 169.54,49.85 169.23,50.16 168.28,50.16 167.32,49.21 | C24.1 34.29,44.89 IC3.14 | 33.65,48.26 33.34,47.94 33.34,46.67 33.65,46.36 34.29,46.36 | R20.2 50.14,49.02 | TP2.P$1 166.37,6.03 168.28,7.94 v168.28,12.06
  Top 0.61: U$1.P$44 177.6,46.16 174.31,42.86 173.99,42.86 | 173.99,42.86 R12.2 | 173.99,42.86 173.99,24.13 168.28,18.41 v168.28,12.06
  Top 0.813: LED9.6 LED8.4 LED8.5 LED8.6 LED7.4 LED7.5 LED7.6 89.53,72.91 LED6.4 LED6.5 LED6.6 LED5.4 LED5.5 LED5.6 LED4.4 LED4.5 LED4.6 LED3.4 LED3.5 LED3.6 58.74,72.91 LED2.4 LED2.5 LED2.6 LED1.4 LED1.5 LED1.6 45.6,72.91 43.5,70.8 43.5,58.86 LED20.4 LED20.5 LED20.6 LED19.4 LED19.5 LED19.6 LED18.4 LED18.5 LED18.6 LED17.4 LED17.5 LED17.6 LED16.4 LED16.5 LED16.6 | LED9.6 LED9.5 LED9.4 LED10.6 LED10.5 LED10.4 LED11.6 LED11.5 LED11.4 LED12.6 | LED12.5 LED12.4 134.62,72.91 LED13.6 LED13.5 LED13.4 LED14.6 LED14.5 LED14.4 LED15.6 LED15.5 LED15.4 | U$10.P$22 v107,53.66 | LED9.6 104.46,72.91 U$10.P$23
  Top 1.016: LED12.6 LED12.5
  Bottom 0.406: U$33.2 100.09,54.84 100.97,53.97 101.6,53.97 101.82,54.19 U$33.28 104.14,54.19 | 104.14,54.19 106.46,54.19 v107,53.66 | v62.55,62.23 62.55,58.42 62.96,58 U$30.28 66.14,58 66.55,57.59 C16.1 | 138.18,63.75 v138.11,63.82 138.11,60.32 v137.79,60.01 137.09,59.3 U$36.3 | U$36.28 140.87,58 v140.33,57.47 140.33,55.37 R7.2 R8.2 | U$10.P$30 v89.22,66.99 | U$51.3 U$51.2 v64.85,32.47 65.5,33.12 U$51.28 65.5,36.48 C15.1 | C17.1 104.14,54.19
  Bottom 0.61: U1.5 122.27,9.87 | 124.78,12.38 125.86,12.38 L1.2 | C3.1 120.97,9.87 | C2.1 118.52,11.37 | R2.2 171.45,7.62 171.63,7.62 L2.2 | U$1.P$43 U$1.P$44 | v168.28,12.06 168.28,6.35
  Bottom 0.813: U1.5 120.97,9.87 U1.4 118.52,11.37 | 122.27,9.87 124.78,12.38 | U$10.P$23 U$10.P$22 | C2.1 110.55,11.37 107,14.92 v107,53.66 | L1.2 136.02,12.57 145.41,3.17 161.92,3.17 164.47,5.71 165.44,5.71 C26.+
  Bottom 1.016: C26.+ 168.28,6.35 L2.2
12V
  Bottom 0.813: X2.1 196.53,31.75 198.75,29.53 198.75,25.08 196.85,23.18 196.85,22.03 PTC1.P$2
  Bottom 1.016: PTC1.P$2 196.73,16.79 X1.1
BTN1
  Top 0.305: IC2.1 R13.1
  Top 0.406: R13.1 C12.2 158.88,49.09 158.75,49.21 161.92,49.21 162.24,48.89 162.88,48.89 163.51,48.26 163.51,34.29 161.92,32.7 153.35,32.7 150.81,30.16 150.81,22.54 153.35,20 153.35,18.08 U$42.P$5
BTN1S  (via drill 0.38)
  Top 0.406: IC2.2 v162.24,47.94
  Bottom 0.406: v162.24,47.94 162.24,56.52 157.8,60.96 154.24,60.96 U$1.P$24
BTN2
  Top 0.305: IC2.3 R10.1 | 162.94,45.78 162.94,45.02
  Top 0.406: R10.1 C13.2 | IC2.3 162.43,46.67 162.94,46.16 162.94,45.78 | 162.94,45.02 162.94,34.54 161.73,33.34 153.03,33.34 150.18,30.48 150.18,21.11 U$42.P$4
BTN2S  (via drill 0.38)
  Top 0.406: IC2.4 v162.24,45.4
  Bottom 0.406: v162.24,45.4 163.19,46.36 163.19,56.52 158.11,61.59 156.15,61.59 U$1.P$26
BTN3
  Top 0.406: C10.2 R11.1 IC2.11 165.42,45.4 164.66,44.64 164.66,33.53 162.56,31.43 153.99,31.43 152.08,29.53 152.08,23.18 154.62,20.64 154.62,16.35 U$42.P$6
BTN3S  (via drill 0.38)
  Top 0.406: IC2.10 v165.42,44.13
  Bottom 0.406: v165.42,44.13 164.47,45.08 164.47,57.15 159.82,61.79 U$1.P$30
BTN4
  Top 0.406: C9.2 R14.1 IC2.13 165.48,47.94 164.66,47.12 164.66,45.59 164.08,45.02 164.08,33.91 162.24,32.07 153.67,32.07 151.45,29.84 151.45,22.86 153.99,20.32 153.99,16.83 152.08,14.92 150.37,14.92 U$42.P$2
BTN4S  (via drill 0.38)
  Top 0.406: IC2.12 v165.42,46.67
  Bottom 0.406: v165.42,46.67 165.42,61.59 166.05,62.23 166.05,64.15 U$1.P$35
BTN5
  Top 0.406: IC2.9 R12.1 | R12.1 C11.2 | R12.1 168.78,41.15 168.28,40.64 166.05,40.64 165.42,40 165.42,33.34 162.88,30.8 154.31,30.8 152.72,29.21 152.72,23.44 152.77,23.44 155.26,20.96 155.26,15.24 152.4,12.38 149.91,12.38 U$42.P$3
BTN5S  (via drill 0.38)
  Top 0.406: IC2.8 v165.42,41.59
  Bottom 0.406: v165.42,41.59 163.83,43.18 163.83,56.83 157.66,63 U$1.P$28
CD  (via drill 0.38)
  Top 0.406: U$10.P$27 94.3,59.37 91.44,56.52 v91.44,52.7 | U$1.P$6 148.39,38.1 v91.44,38.1
  Bottom 0.406: v91.44,52.7 v91.44,38.1
GND  (via drill 0.38)
  other vias: 96.52,62.55 100.65,58.42 99.69,53.66 42.86,39.37
  pour Top: 0.32,0 200.98,0 200.98,74.61 0.32,74.61
  pour Bottom: 0.32,0 200.98,0 200.98,74.61 0.32,74.61
LCD_CLOCK  (via drill 0.38)
  Top 0.406: U$10.P$32 81.6,53.02 v81.91,52.7 | U$1.P$3 88.99,36.74 v81.91,43.81
  Bottom 0.406: v81.91,52.7 81.91,48.89 v81.91,43.81
LCD_CS  (via drill 0.38)
  Top 0.406: U$10.P$28 91.76,58.1 90.17,56.52 v90.17,52.7 | U$1.P$7 146.94,41.91 v90.17,41.91
  Bottom 0.406: v90.17,52.7 v90.17,41.91
LCD_DATA  (via drill 0.38)
  Top 0.406: U$1.P$5 88.35,39.28 v84.46,43.18 | v84.46,52.7 84.14,53.02 U$10.P$31
  Bottom 0.406: v84.46,43.18 v84.46,52.7
LCD_RESET  (via drill 0.38)
  Top 0.406: U$10.P$29 89.22,53.02 v88.9,52.7 | v88.9,40.64 148.39,40.64 U$1.P$8
  Bottom 0.406: v88.9,52.7 v88.9,40.64
N$1
  Top 0.406: U$10.P$14 113.35,4.76 85.41,4.76 U$10.P$2
N$2
  Top 0.406: U$10.P$3 87.95,2.22 115.89,2.22 U$10.P$15
N$3
  Bottom 0.406: U1.3 120.02,3.81 U$10.P$16
  Bottom 0.61: U1.3 118.97,7.27 R1.1
N$4
  Bottom 0.61: C1.1 123.89,1.59 122.56,1.59 D1.C 121.92,1.59 83.5,1.59 U$10.P$1
N$5
  Bottom 0.61: L1.1 125.89,7.27 U1.1 121.92,5.71 D1.A
N$6
  Bottom 1.016: 181.43,10.48 181.43,11.61 172.92,20.12 IC1.2 | 181.43,10.48 L2.1 | D2.C 187.22,10.48 181.43,10.48
N$7  (via drill 0.38)
  Top 0.406: v48.9,60.96 48.9,68.63 LED1.3
  Bottom 0.406: U$30.6 49.19,61.25 v48.9,60.96
N$8  (via drill 0.38)
  Top 0.406: v47.31,61.59 LED1.2
  Bottom 0.406: U$30.7 47.62,61.91 v47.31,61.59
N$9
  Bottom 0.61: IC1.4 171.45,16.71 | 171.45,16.71 R2.1 | R3.2 171.45,16.71
N$10  (via drill 0.38)
  Top 0.406: v45.72,62.55 LED1.1
  Bottom 0.406: U$30.8 v45.73,62.55 v45.72,62.55
N$11  (via drill 0.38)
  Top 0.406: v56.51,63.5 56.51,68.63 LED2.3
  Bottom 0.406: U$30.9 56.81,63.2 v56.51,63.5
N$12  (via drill 0.38)
  Top 0.406: v54.93,64.13 LED2.2
  Bottom 0.406: U$30.11 55.3,64.5 v54.93,64.13
N$13  (via drill 0.38)
  Top 0.406: v53.34,65.09 LED2.1
  Bottom 0.406: U$30.12 53.41,65.16 v53.34,65.09
N$14  (via drill 0.38)
  Top 0.406: v64.13,66.36 64.13,68.63 LED3.3
  Bottom 0.406: U$30.13 63.58,65.8 v64.13,66.36
N$15  (via drill 0.38)
  Top 0.406: v62.55,66.67 LED3.2
  Bottom 0.406: U$30.14 62.33,66.45 v62.55,66.67
N$16  (via drill 0.38)
  Top 0.406: v60.96,70.48 60.96,68.66 LED3.1
  Bottom 0.406: U$30.15 65.47,70.11 65.09,70.48 v60.96,70.48
N$17  (via drill 0.38)
  Top 0.406: v71.75,66.04 71.75,68.63 LED4.3
  Bottom 0.406: U$30.16 71.52,65.8 v71.75,66.04
N$18  (via drill 0.38)
  Top 0.406: v70.17,64.77 LED4.2
  Bottom 0.406: U$30.17 69.78,65.16 v70.17,64.77
N$19  (via drill 0.38)
  Top 0.406: v68.58,64.13 LED4.1
  Bottom 0.406: U$30.18 68.21,64.5 v68.58,64.13
N$20  (via drill 0.38)
  Top 0.406: v79.38,63.18 79.38,68.63 LED5.3
  Bottom 0.406: U$30.20 79.35,63.2 v79.38,63.18
N$21  (via drill 0.38)
  Top 0.406: v77.79,62.23 LED5.2
  Bottom 0.406: U$30.21 77.46,62.55 v77.79,62.23
N$22  (via drill 0.38)
  Top 0.406: v76.2,61.59 LED5.1
  Bottom 0.406: U$30.22 75.89,61.91 v76.2,61.59
N$23  (via drill 0.38)
  Top 0.406: LED6.3 87.01,66.66 87.95,65.72 v87.95,57.15
  Bottom 0.406: U$33.6 88.24,57.44 v87.95,57.15
N$24  (via drill 0.38)
  Top 0.406: v85.41,57.78 LED6.2
  Bottom 0.406: U$33.7 85.72,58.09 v85.41,57.78
N$25  (via drill 0.38)
  Top 0.406: LED6.1 83.81,66.66 82.87,65.72 v82.87,58.74
  Bottom 0.406: U$33.8 v82.88,58.74 v82.87,58.74
N$26  (via drill 0.38)
  Top 0.406: LED7.3 94.63,66.66 95.57,65.72 v95.57,59.69
  Bottom 0.406: U$33.9 95.91,59.39 v95.57,59.69
N$27  (via drill 0.38)
  Top 0.406: LED7.2 v93.03,60.32
  Bottom 0.406: U$33.11 93.4,60.69 v93.03,60.32
N$28  (via drill 0.38)
  Top 0.406: LED7.1 91.43,66.66 90.49,65.72 v90.49,61.59
  Bottom 0.406: U$33.12 90.74,61.34 v90.49,61.59
N$29  (via drill 0.38)
  Top 0.406: v102.23,66.04 102.23,68.63 LED8.3
  Bottom 0.406: U$33.13 101.05,61.99 103.19,64.13 103.19,65.09 v102.23,66.04
N$30  (via drill 0.38)
  Top 0.406: v100.65,66.04 LED8.2
  Bottom 0.406: U$33.14 99.47,62.64 100.65,63.82 v100.65,66.04
N$31  (via drill 0.38)
  Top 0.406: v100.97,60.96 100.65,60.96 98.11,63.5 98.11,65.41 99.06,66.36 LED8.1
  Bottom 0.406: U$33.15 102.65,62.64 v100.97,60.96
N$32  (via drill 0.38)
  Top 0.406: LED9.3 109.87,66.66 110.81,65.72 v110.81,62.23
  Bottom 0.406: U$33.16 110.57,61.99 v110.81,62.23
N$33  (via drill 0.38)
  Top 0.406: LED9.2 v108.27,60.96
  Bottom 0.406: U$33.17 107.88,61.34 v108.27,60.96
N$34  (via drill 0.38)
  Top 0.406: LED9.1 106.67,66.66 105.73,65.72 v105.73,60.32
  Bottom 0.406: U$33.18 105.36,60.69 v105.73,60.32
N$35  (via drill 0.38)
  Top 0.406: LED10.3 117.49,66.66 118.43,65.72 v118.43,59.37
  Bottom 0.406: U$33.20 118.41,59.39 v118.43,59.37
N$36  (via drill 0.38)
  Top 0.406: v115.89,58.42 LED10.2
  Bottom 0.406: U$33.21 115.56,58.74 v115.89,58.42
N$37  (via drill 0.38)
  Top 0.406: LED10.1 114.29,66.66 113.35,65.72 v113.35,57.78
  Bottom 0.406: U$33.22 113.04,58.09 v113.35,57.78
N$38  (via drill 0.38)
  Top 0.406: v125.09,60.96 125.09,68.63 LED11.3
  Bottom 0.406: U$36.6 125.39,61.25 v125.09,60.96
N$39  (via drill 0.38)
  Top 0.406: v123.51,61.59 LED11.2
  Bottom 0.406: U$36.7 123.82,61.91 v123.51,61.59
N$40  (via drill 0.38)
  Top 0.406: v121.92,62.55 LED11.1
  Bottom 0.406: U$36.8 v121.93,62.55 v121.92,62.55
N$41  (via drill 0.38)
  Top 0.406: v132.72,63.5 132.72,68.63 LED12.3
  Bottom 0.406: U$36.9 133.01,63.2 v132.72,63.5
N$42  (via drill 0.38)
  Top 0.406: v131.13,64.13 LED12.2
  Bottom 0.406: U$36.11 131.5,64.5 v131.13,64.13
N$43  (via drill 0.38)
  Top 0.406: v129.54,65.41 LED12.1
  Bottom 0.406: U$36.12 129.79,65.16 v129.54,65.41
N$44  (via drill 0.38)
  Top 0.406: v140.33,66.67 140.33,68.63 LED13.3
  Bottom 0.406: U$36.13 139.47,65.8 v140.33,66.67
N$45  (via drill 0.38)
  Top 0.406: v138.75,66.67 LED13.2
  Bottom 0.406: U$36.14 138.53,66.45 v138.75,66.67
N$46  (via drill 0.38)
  Top 0.406: v137.16,70.48 137.16,68.66 LED13.1
  Bottom 0.406: U$36.15 141.66,69.79 140.97,70.48 v137.16,70.48
N$47  (via drill 0.38)
  Top 0.406: v147.95,66.04 147.95,68.63 LED14.3
  Bottom 0.406: U$36.16 147.72,65.8 v147.95,66.04
N$48  (via drill 0.38)
  Top 0.406: v146.37,64.77 LED14.2
  Bottom 0.406: U$36.17 145.98,65.16 v146.37,64.77
N$49  (via drill 0.38)
  Top 0.406: v144.78,64.13 LED14.1
  Bottom 0.406: U$36.18 144.41,64.5 v144.78,64.13
N$50  (via drill 0.38)
  Top 0.406: v155.57,70.48 155.57,68.66 LED15.3
  Bottom 0.406: U$36.20 146.39,63.2 149.22,66.04 149.22,69.85 150.81,71.44 154.62,71.44 v155.57,70.48
N$51  (via drill 0.38)
  Top 0.406: v153.99,70.48 LED15.2
  Bottom 0.406: U$36.21 146.69,62.55 149.86,65.72 149.86,69.53 151.13,70.8 153.67,70.8 v153.99,70.48
N$52  (via drill 0.38)
  Top 0.406: v145.73,61.59 152.4,68.26 LED15.1
  Bottom 0.406: U$36.22 145.42,61.91 v145.73,61.59
N$53
  Bottom 0.406: U$30.1 57.82,58 R4.1
N$54  (via drill 0.38)
  Top 0.406: v62.55,16.51 LED16.3
  Bottom 0.406: U$51.6 62.25,16.8 v62.55,16.51
N$55
  Bottom 0.406: U$33.1 95.91,54.19 R5.1
N$56
  Bottom 0.406: U$36.1 133.98,58 R6.1
N$57
  Bottom 0.406: U$10.P$20 112.08,66.67 C6.1
N$58
  Bottom 0.406: U$10.P$21 109.54,66.99 111.44,68.9 C7.1
N$59
  Bottom 0.406: U$10.P$19 114.62,66.67 C6.2
N$60
  Bottom 0.406: U$10.P$18 117.16,66.99 115.25,68.9 C7.2
N$61
  Bottom 0.406: U$10.P$17 C8.2 121.54,66.23 R9.2
N$62  (via drill 0.38)
  Top 0.406: v61.91,14.92 LED16.2
  Bottom 0.406: U$51.7 61.6,15.23 v61.91,14.92
N$63  (via drill 0.38)
  Top 0.406: v60.96,13.33 54.56,13.33 LED16.1
  Bottom 0.406: U$51.8 60.95,13.34 v60.96,13.33
N$64  (via drill 0.38)
  Top 0.406: v60.01,25.4 LED17.3
  Bottom 0.406: U$51.9 60.3,25.74 v60.01,25.4
N$65  (via drill 0.38)
  Top 0.406: v59.37,23.81 LED17.2
  Bottom 0.406: U$51.11 59,24.18 v59.37,23.81
N$66  (via drill 0.38)
  Top 0.406: v58.42,22.22 54.56,22.22 LED17.1
  Bottom 0.406: U$51.12 58.35,22.29 v58.42,22.22
N$67  (via drill 0.38)
  Top 0.406: v56.2,33.97 55.87,34.3 LED18.3
  Bottom 0.406: U$51.13 57.7,32.47 v56.2,33.97
N$68  (via drill 0.38)
  Top 0.406: v56.2,32.7 LED18.2
  Bottom 0.406: U$51.14 57.05,31.85 v56.2,32.7
N$69  (via drill 0.38)
  Top 0.406: v52.39,32.7 53.99,31.1 LED18.1
  Bottom 0.406: U$51.15 52.76,35.62 52.39,35.24 v52.39,32.7
N$70  (via drill 0.38)
  Top 0.406: v57.79,43.18 LED19.3
  Bottom 0.406: U$51.16 57.7,43.1 v57.79,43.18
N$71  (via drill 0.38)
  Top 0.406: v58.74,41.59 LED19.2
  Bottom 0.406: U$51.17 58.35,41.21 v58.74,41.59
N$72  (via drill 0.38)
  Top 0.406: v59.37,40 54.56,40 LED19.1
  Bottom 0.406: U$51.18 59,39.64 v59.37,40
N$73  (via drill 0.38)
  Top 0.406: v60.32,52.07 LED20.3
  Bottom 0.406: U$51.20 60.3,52.05 v60.32,52.07
N$74  (via drill 0.38)
  Top 0.406: v61.28,50.48 LED20.2
  Bottom 0.406: U$51.21 60.95,50.16 v61.28,50.48
N$75  (via drill 0.38)
  Top 0.406: v61.91,48.89 54.56,48.89 LED20.1
  Bottom 0.406: U$51.22 61.6,48.58 v61.91,48.89
N$76
  Bottom 0.406: U$51.1 65.5,29.24 R15.1
SCL  (via drill 0.38)
  Top 0.406: v101.28,56.2 100.65,55.56 v93.66,55.56 | v64.13,56.2 64.13,57.97 U$30.26 68.19,59.3 v68.26,59.37
  Bottom 0.406: v101.28,56.2 101.98,55.49 U$33.26 136.14,55.49 139.95,59.3 U$36.26 143.64,59.3 | v93.66,55.56 83.5,55.56 79.76,59.3 68.33,59.3 v68.26,59.37 68.19,59.3 U$30.26 | U$51.26 64.2,56.13 v64.13,56.2 | R8.1 143.64,59.3 | 143.64,59.3 146.73,59.3 U$1.P$21
SDA  (via drill 0.38)
  Top 0.406: v101.28,54.93 94.3,54.93 93.98,54.61 v93.03,54.61 | v67.63,58.42 67.39,58.66 65.64,58.66 64.77,57.78 64.77,56.83 65.09,56.52 v65.09,55.56
  Bottom 0.406: v101.28,54.93 101.36,54.84 U$33.27 136.44,54.84 137.32,55.72 | v93.03,54.61 92.71,54.93 83.19,54.93 79.38,58.74 68.9,58.74 68.58,58.42 v67.63,58.42 67.39,58.66 U$30.27 | U$36.27 140.25,58.66 137.32,55.72 | U$51.27 64.85,55.33 v65.09,55.56 | 137.32,55.72 137.79,55.24 R7.1 138.94,54.74 139.7,53.97 144.14,53.97 145.1,54.93 145.1,57.15 146.37,58.42 148.39,58.42 U$1.P$22
SW1  (via drill 0.38)
  Top 0.406: C22.2 R16.1 IC3.1 34.29,40.96 v34.61,41.27
  Bottom 0.406: S1.3 S1.4 21.55,29.17 22.23,29.84 22.23,40.32 23.18,41.27 v34.61,41.27
SW1S  (via drill 0.38)
  Top 0.406: IC3.2 35.56,41.59 36.2,42.23 37.15,42.23 37.78,41.59 42.23,41.59 44.13,43.5 44.13,45.08 45.09,46.04 v45.72,46.04 | U$1.P$11 146.16,46.04 59.05,46.04 58.74,45.72 56.2,45.72 v55.88,46.04
  Bottom 0.406: v45.72,46.04 46.04,45.72 48.58,45.72 48.9,46.04 53.66,46.04 53.98,46.36 55.56,46.36 v55.88,46.04
SW2  (via drill 0.38)
  Top 0.406: C23.2 R17.1 IC3.3 v36.83,41.27
  Bottom 0.406: v36.83,41.27 35.88,42.23 30.8,42.23 28.93,44.09 S2.4 S2.3
SW2S  (via drill 0.38)
  Top 0.406: IC3.4 38.1,40.64 38.42,40.96 42.54,40.96 44.77,43.18 44.77,44.45 v45.4,45.08 | U$1.P$9 145.99,45.4 59.37,45.4 59.05,45.08 55.56,45.08 v55.24,45.4
  Bottom 0.406: v45.4,45.08 48.9,45.08 49.21,45.4 53.98,45.4 54.29,45.72 54.93,45.72 v55.24,45.4
SW3  (via drill 0.38)
  Top 0.305: R18.1 IC3.11
  Top 0.406: C20.2 R18.1 | v38.74,43.81 38.1,44.45 IC3.11
  Bottom 0.406: v38.74,43.81 37.78,42.86 34.93,42.86 26.43,51.36 S3.3 S3.4
SW3S  (via drill 0.38)
  Top 0.305: IC3.10 39.37,44.45
  Top 0.406: 39.37,44.45 40.96,42.86 41.59,42.86 42.86,44.13 42.86,45.72 44.77,47.62 46.67,47.62 v46.99,47.31 | U$1.P$15 145.41,50.37 145.41,48.89 143.83,47.31 58.42,47.31 58.1,46.99 57.47,46.99 v57.15,47.31
  Bottom 0.406: v46.99,47.31 47.31,46.99 47.94,46.99 48.26,47.31 53.02,47.31 53.34,47.62 56.83,47.62 v57.15,47.31
SW4  (via drill 0.38)
  Top 0.406: C19.2 R19.1 IC3.13 v35.56,43.81
  Bottom 0.406: v35.56,43.81 29.17,50.2 S4.4 S4.3
SW4S  (via drill 0.38)
  Top 0.406: IC3.12 36.83,44.45 39.05,42.23 41.91,42.23 43.5,43.81 43.5,45.4 45.09,46.99 46.04,46.99 v46.35,46.67 | U$1.P$13 144.26,46.67 58.74,46.67 58.42,46.36 56.83,46.36 v56.51,46.67
  Bottom 0.406: v46.35,46.67 46.67,46.36 48.26,46.36 48.58,46.67 53.34,46.67 53.66,46.99 56.2,46.99 v56.51,46.67
SW5  (via drill 0.38)
  Top 0.406: C21.2 R20.1 IC3.9 40.64,44.45 v41.27,43.81
  Bottom 0.406: S5.3 S5.4 35.28,60.6 39.37,56.52 39.37,45.72 v41.27,43.81
SW5S  (via drill 0.38)
  Top 0.406: IC3.8 41.91,46.67 43.5,48.26 47.31,48.26 v47.63,47.94 | v57.79,47.94 143.51,47.94 144.78,49.21 144.78,52.27 U$1.P$17
  Bottom 0.406: v57.79,47.94 57.47,48.26 53.02,48.26 52.71,47.94 v47.63,47.94
SW6
  Top 0.305: S6.3 S6.4 39.33,29.17 42.23,32.07 42.23,35.69 C4.2
  Top 0.406: IC3.5 R21.1 40.32,37.59 C4.2
SW6S  (via drill 0.38)
  Top 0.305: IC3.6 40.64,38.73
  Top 0.406: 40.64,38.73 41.59,37.78 43.18,37.78 43.82,38.42 43.82,41.27 45.4,42.86 45.4,43.81 v45.72,44.13 | U$1.P$10 148.39,43.18 146.37,43.18 144.78,44.77 59.69,44.77 59.37,44.45 54.93,44.45 v54.61,44.77
  Bottom 0.406: v45.72,44.13 46.04,44.45 49.21,44.45 49.53,44.77 v54.61,44.77
VSUP  (via drill 0.6)
  Top 0.406: TP1.P$1 158.11,14.6 166.69,23.18 v168.28,23.18
  Bottom 0.406: v168.28,23.18 168.28,21.89 IC1.1
  Bottom 1.016: IC1.1 175.67,21.82 178.44,19.05 C25.+ 180.32,18.1 180.34,18.1 184.15,21.91 PTC1.P$1
~RESET  (via drill 0.38)
  Top 0.406: v101.28,57.47 100.33,56.52 v94.3,56.52 | v63.18,56.83 63.5,57.15 63.5,58.42 65.03,59.95 67.57,59.95 67.94,60.32 v68.9,60.32
  Bottom 0.406: v101.28,57.47 102.6,56.14 U$33.25 135.84,56.14 139.65,59.95 U$36.25 145.68,59.95 146.69,60.96 150.5,60.96 151.76,59.69 151.76,36.19 151.13,35.56 148.39,35.56 U$1.P$1 | v94.3,56.52 93.34,56.52 93.03,56.2 83.82,56.2 80.01,60.01 69.22,60.01 v68.9,60.32 67.94,60.32 67.57,59.95 U$30.25 | v63.18,56.83 63.18,55.88 63.55,55.51 U$51.25

### Text on the board
bNames: AUX Power | +
tSilk: GND | 12V | 3.3V
_tsilk: Dashboard / Version 1